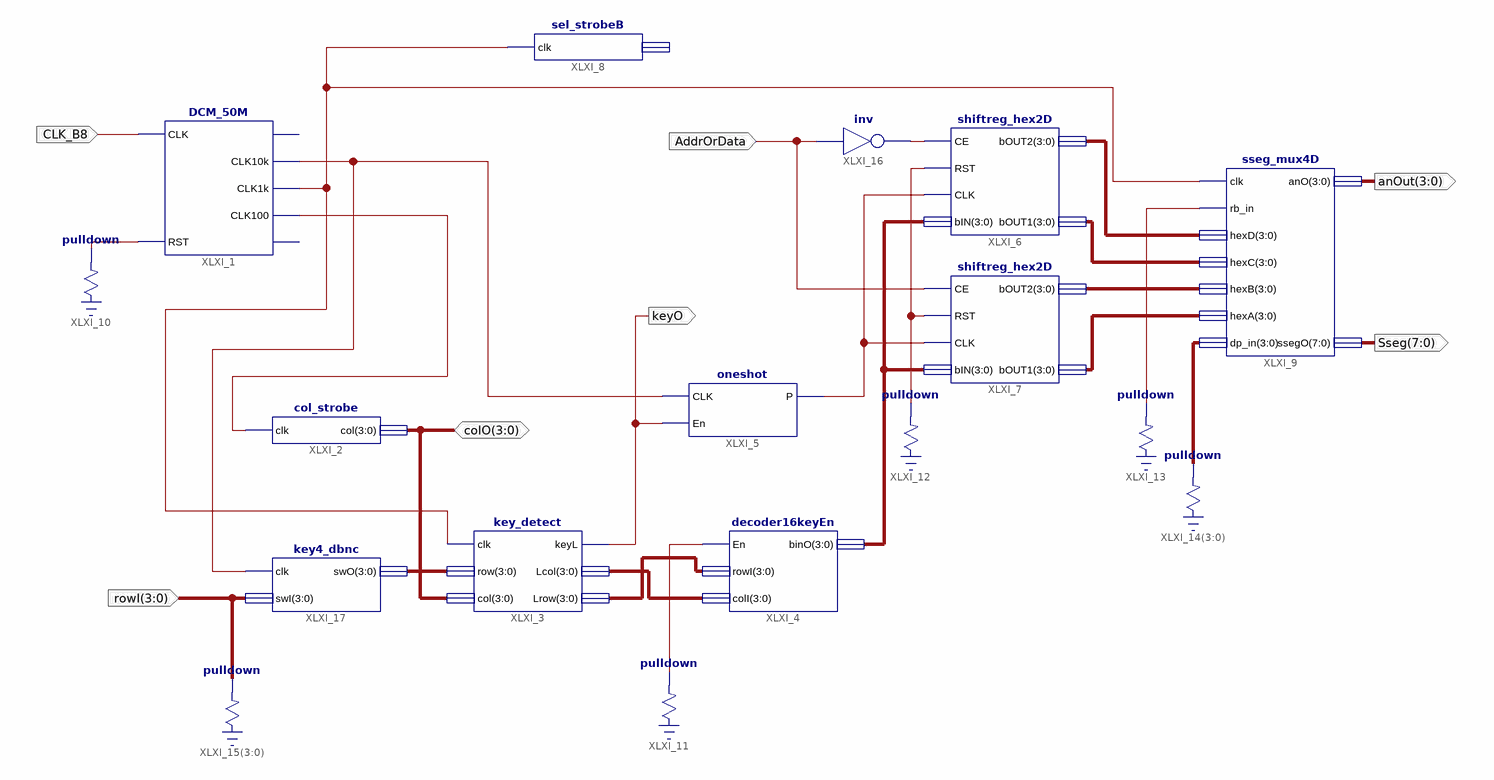
[diagram p0: schematic sheet 1]
// Xilinx ISE schematic keypad_module.sch (spartan3e) as structural Verilog: 17 symbols, 7 ports
module keypad_module (
  input  CLK_B8,
  input  AddrOrData,
  input  [3:0] rowI,
  inout  [3:0] colO,
  output keyO,
  output [3:0] anOut,
  output [7:0] Sseg
);

  wire XLXN_1, XLXN_2, XLXN_3, XLXN_6, XLXN_8, XLXN_9, XLXN_19, XLXN_22, XLXN_34;
  wire [3:0] XLXN_7, XLXN_13, XLXN_14, XLXN_20, XLXN_24, XLXN_25, XLXN_26, XLXN_27, XLXN_36;

  DCM_50M XLXI_1 (.CLK(CLK_B8), .RST(XLXN_1), .CLK10k(XLXN_34), .CLK1k(XLXN_9), .CLK100(XLXN_8));  // open: CLK1M, CLK1
  col_strobe XLXI_2 (.clk(XLXN_8), .col(colO));
  key_detect XLXI_3 (.clk(XLXN_9), .row(XLXN_36), .col(colO), .keyL(keyO), .Lcol(XLXN_14), .Lrow(XLXN_13));
  decoder16keyEn XLXI_4 (.En(XLXN_2), .rowI(XLXN_13), .colI(XLXN_14), .binO(XLXN_20));
  oneshot XLXI_5 (.CLK(XLXN_34), .En(keyO), .P(XLXN_19));
  shiftreg_hex2D XLXI_6 (.CE(XLXN_22), .RST(XLXN_3), .CLK(XLXN_19), .bIN(XLXN_20), .bOUT2(XLXN_27), .bOUT1(XLXN_26));
  shiftreg_hex2D XLXI_7 (.CE(AddrOrData), .RST(XLXN_3), .CLK(XLXN_19), .bIN(XLXN_20), .bOUT2(XLXN_25), .bOUT1(XLXN_24));
  sel_strobeB XLXI_8 (.clk(XLXN_9));  // open: sel
  sseg_mux4D XLXI_9 (
    .clk(XLXN_9), .rb_in(XLXN_6), .hexD(XLXN_27), .hexC(XLXN_26), .hexB(XLXN_25), .hexA(XLXN_24),
    .dp_in(XLXN_7), .anO(anOut), .ssegO(Sseg));
  \pulldown  XLXI_10 (.O(XLXN_1));
  \pulldown  XLXI_11 (.O(XLXN_2));
  \pulldown  XLXI_12 (.O(XLXN_3));
  \pulldown  XLXI_13 (.O(XLXN_6));
  \pulldown  XLXI_14[3:0] (.O(XLXN_7));
  \pulldown  XLXI_15[3:0] (.O(rowI));
  not XLXI_16 (XLXN_22, AddrOrData);
  key4_dbnc XLXI_17 (.clk(XLXN_34), .swI(rowI), .swO(XLXN_36));
endmodule
